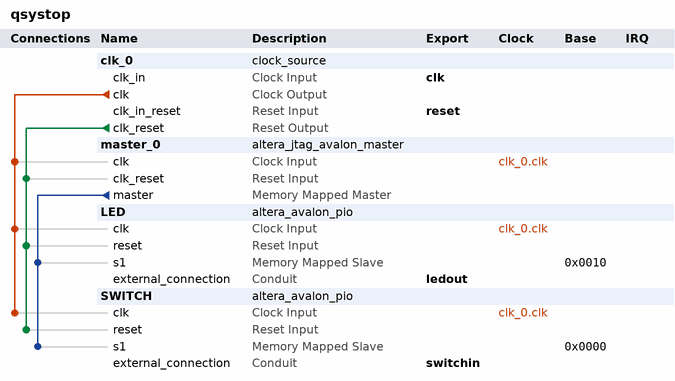
[diagram p0: system contents]
# Platform Designer (Qsys) system qsystop, Cyclone V 5CSEMA5F31C6
# Parameters at their usual value, and those the tool derives, are not listed.
package require -exact qsys 17.0
create_system qsystop
set_project_property DEVICE_FAMILY {Cyclone V}
set_project_property DEVICE 5CSEMA5F31C6

add_instance clk_0 clock_source 17.0
set_instance_parameter_value clk_0 clockFrequency 50000000

add_instance master_0 altera_jtag_avalon_master 17.0

add_instance LED altera_avalon_pio 17.0
set_instance_parameter_value LED direction Output
set_instance_parameter_value LED width 8

add_instance SWITCH altera_avalon_pio 17.0
set_instance_parameter_value SWITCH direction Input
set_instance_parameter_value SWITCH width 8

# connections
add_connection clk_0.clk LED.clk clock
add_connection clk_0.clk master_0.clk clock
add_connection clk_0.clk SWITCH.clk clock
add_connection clk_0.clk_reset LED.reset reset
add_connection clk_0.clk_reset master_0.clk_reset reset
add_connection clk_0.clk_reset SWITCH.reset reset
add_connection master_0.master LED.s1 avalon
set_connection_parameter_value master_0.master/LED.s1 baseAddress 0x0010
add_connection master_0.master SWITCH.s1 avalon
set_connection_parameter_value master_0.master/SWITCH.s1 baseAddress 0x0000

# exported interfaces
add_interface clk clock sink
set_interface_property clk EXPORT_OF clk_0.clk_in
add_interface ledout conduit end
set_interface_property ledout EXPORT_OF LED.external_connection
add_interface reset reset sink
set_interface_property reset EXPORT_OF clk_0.clk_in_reset
add_interface switchin conduit end
set_interface_property switchin EXPORT_OF SWITCH.external_connection

set_interconnect_requirement {$system} qsys_mm.clockCrossingAdapter HANDSHAKE
set_interconnect_requirement {$system} qsys_mm.enableEccProtection FALSE
set_interconnect_requirement {$system} qsys_mm.insertDefaultSlave FALSE
set_interconnect_requirement {$system} qsys_mm.maxAdditionalLatency 1

save_system qsystop.qsys
